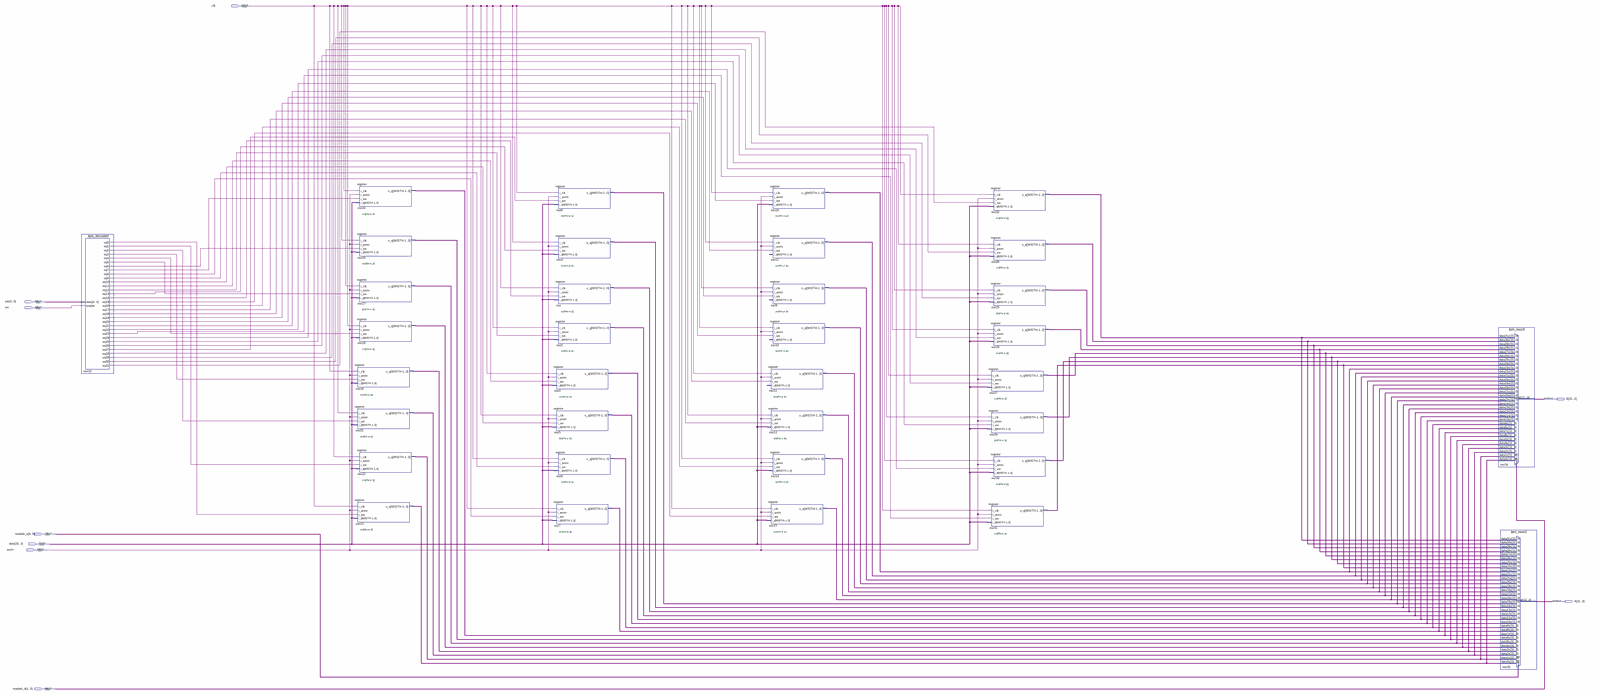
[diagram p0: schematic sheet, whole]
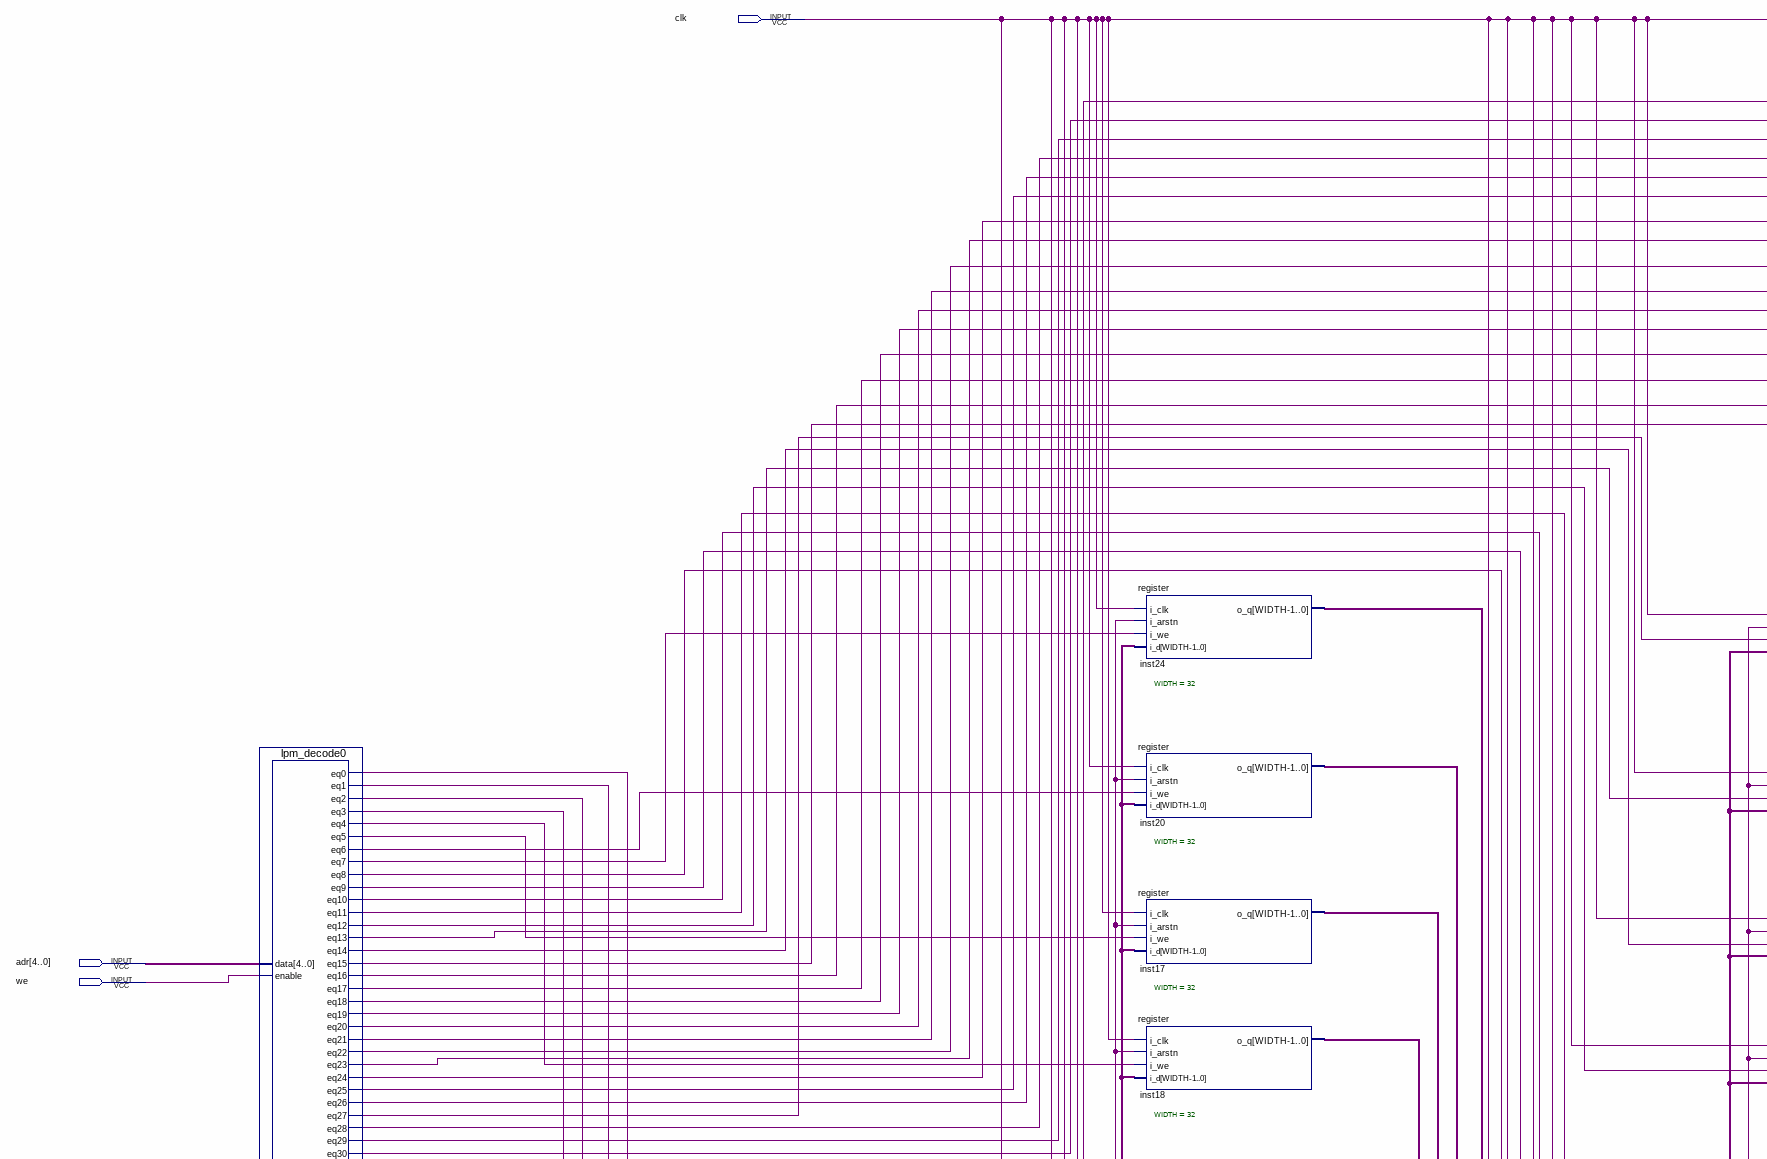
[diagram p1: schematic sheet, upper left part]
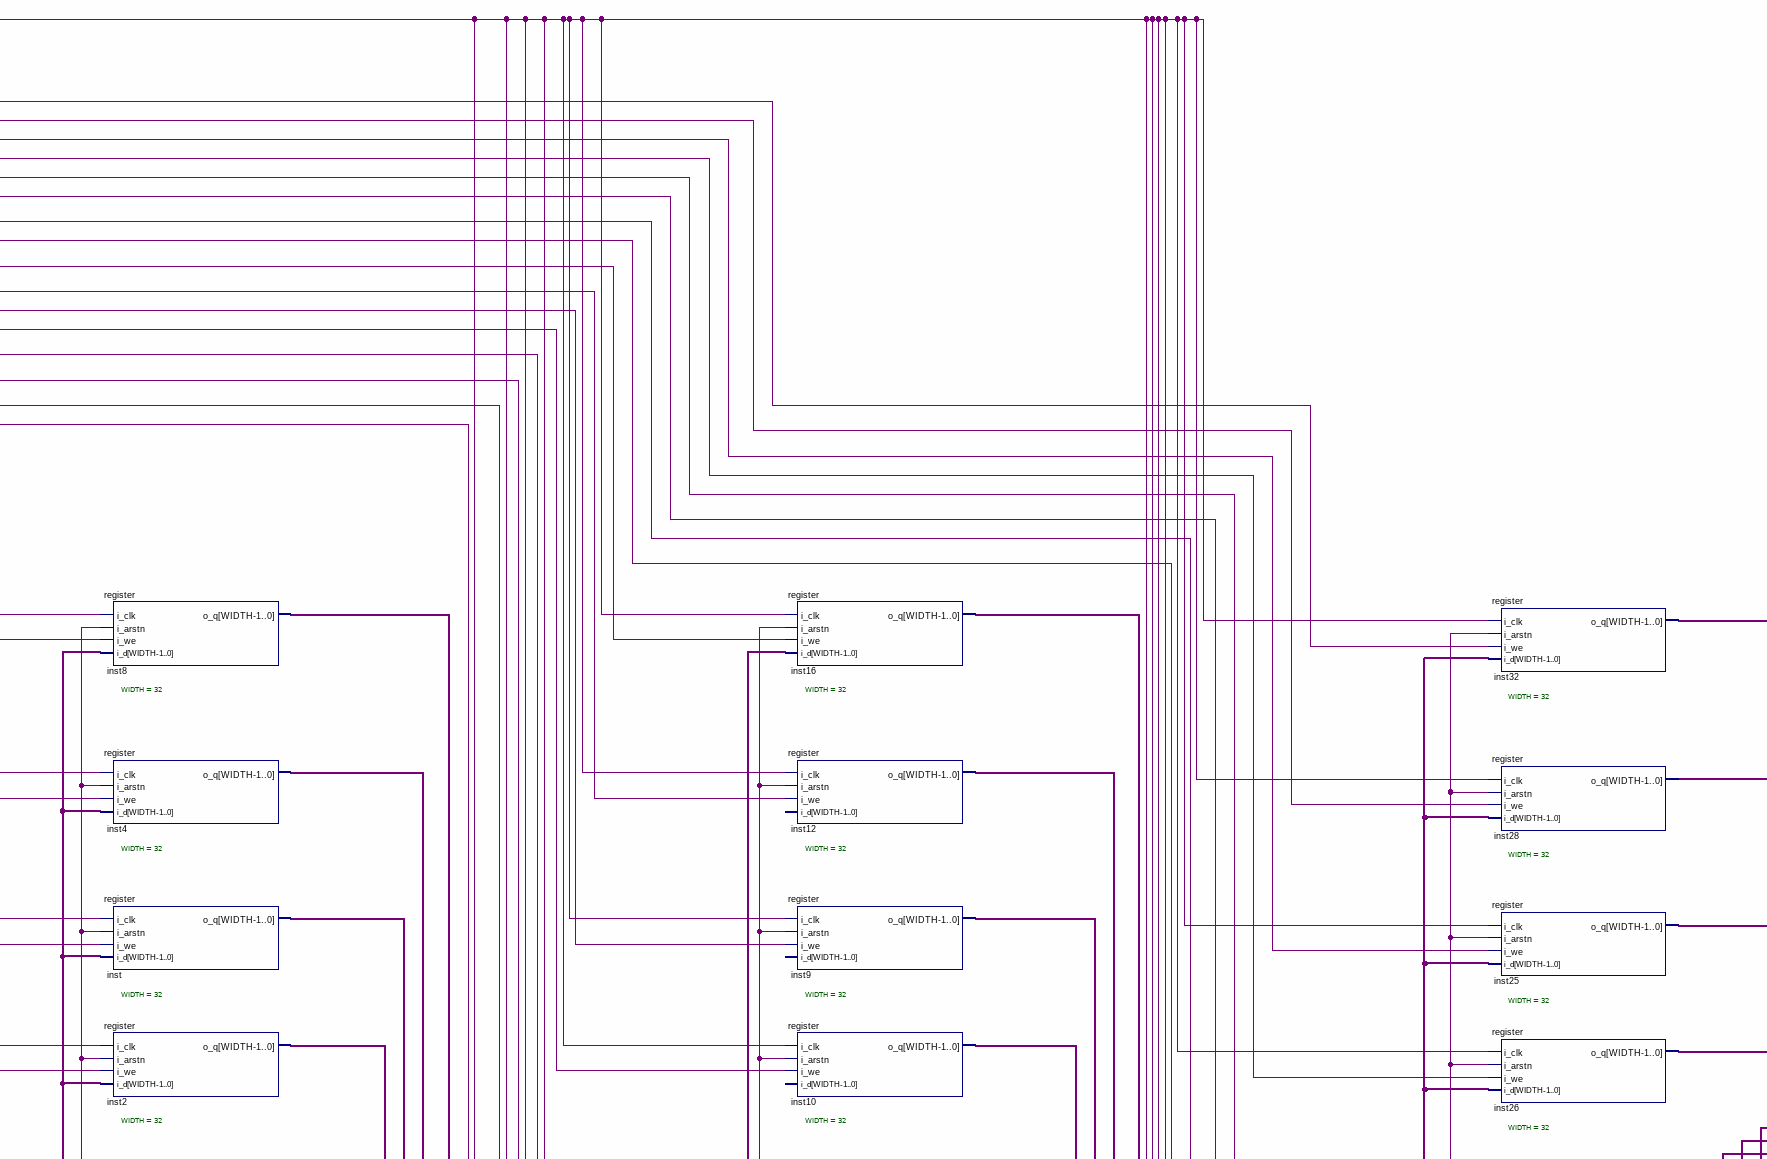
[diagram p2: schematic sheet, upper centre part]
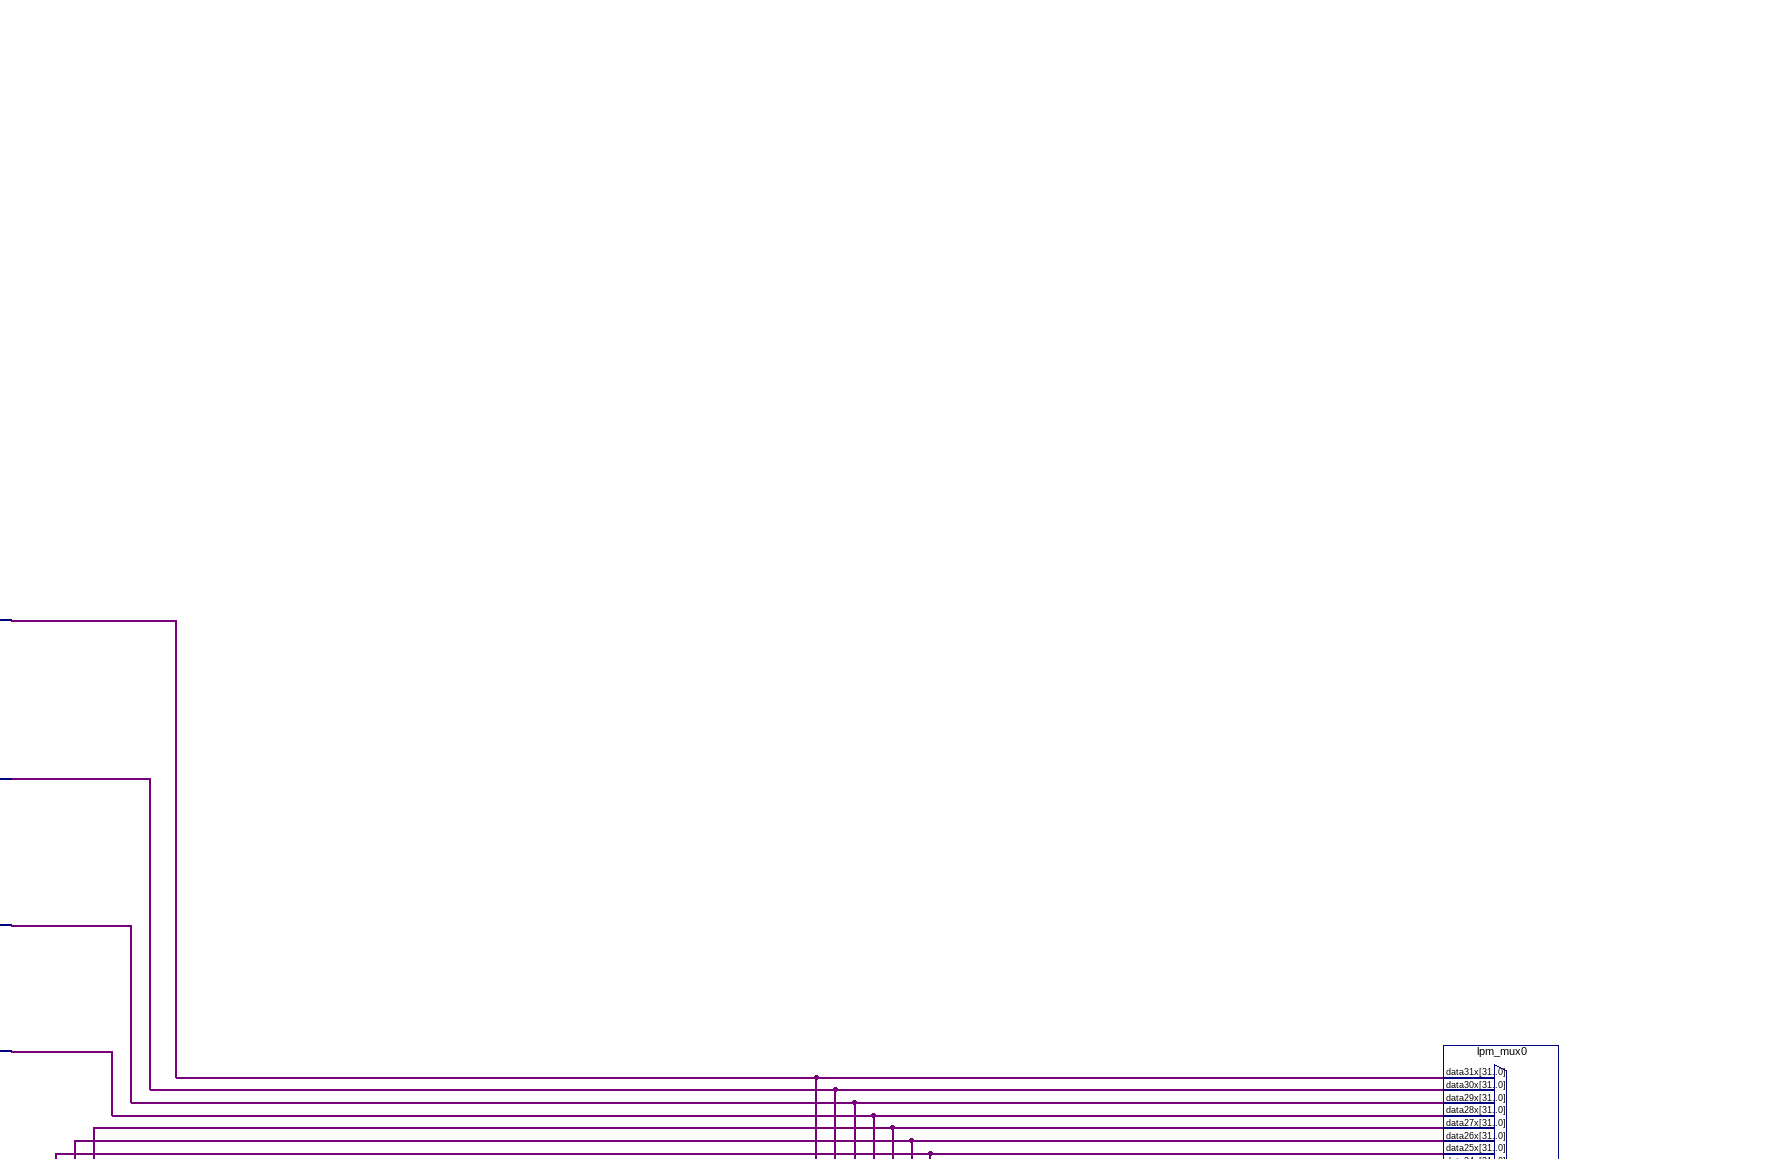
[diagram p3: schematic sheet, upper right part]
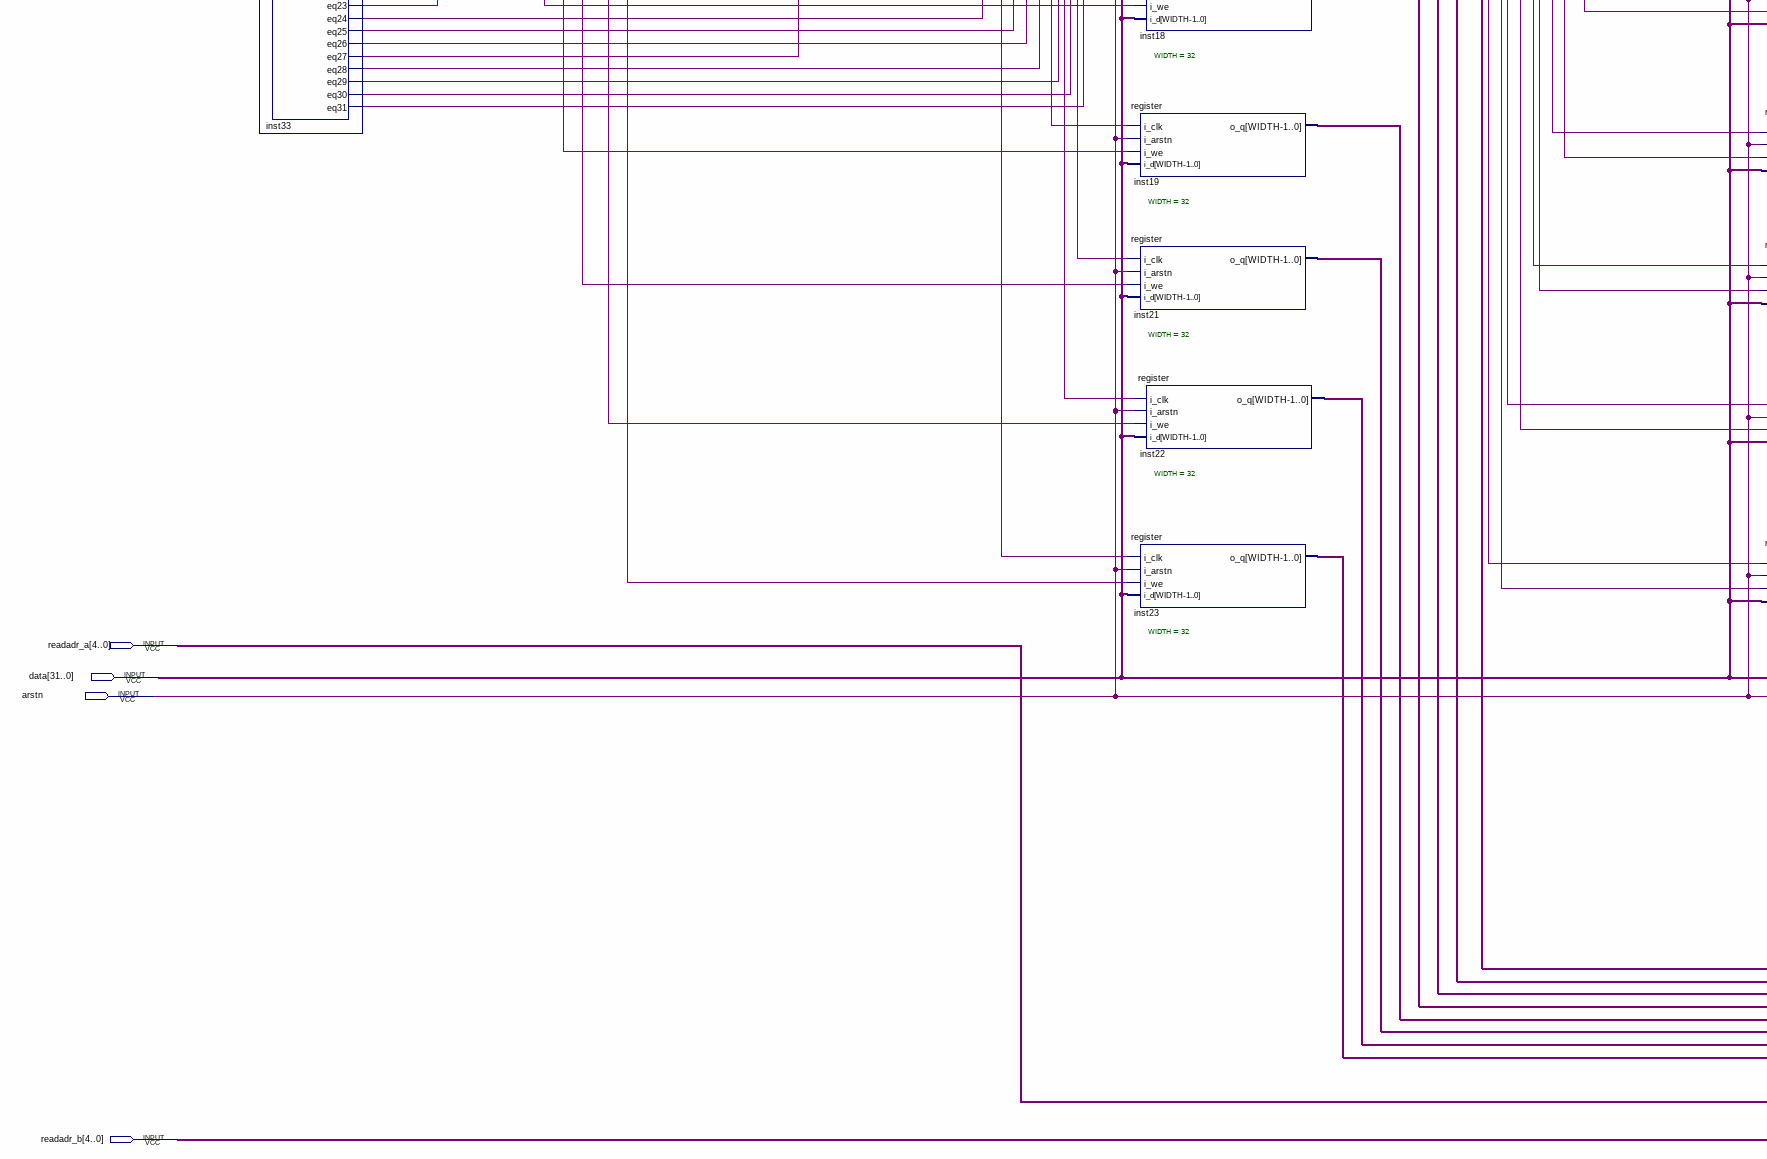
[diagram p4: schematic sheet, lower left part]
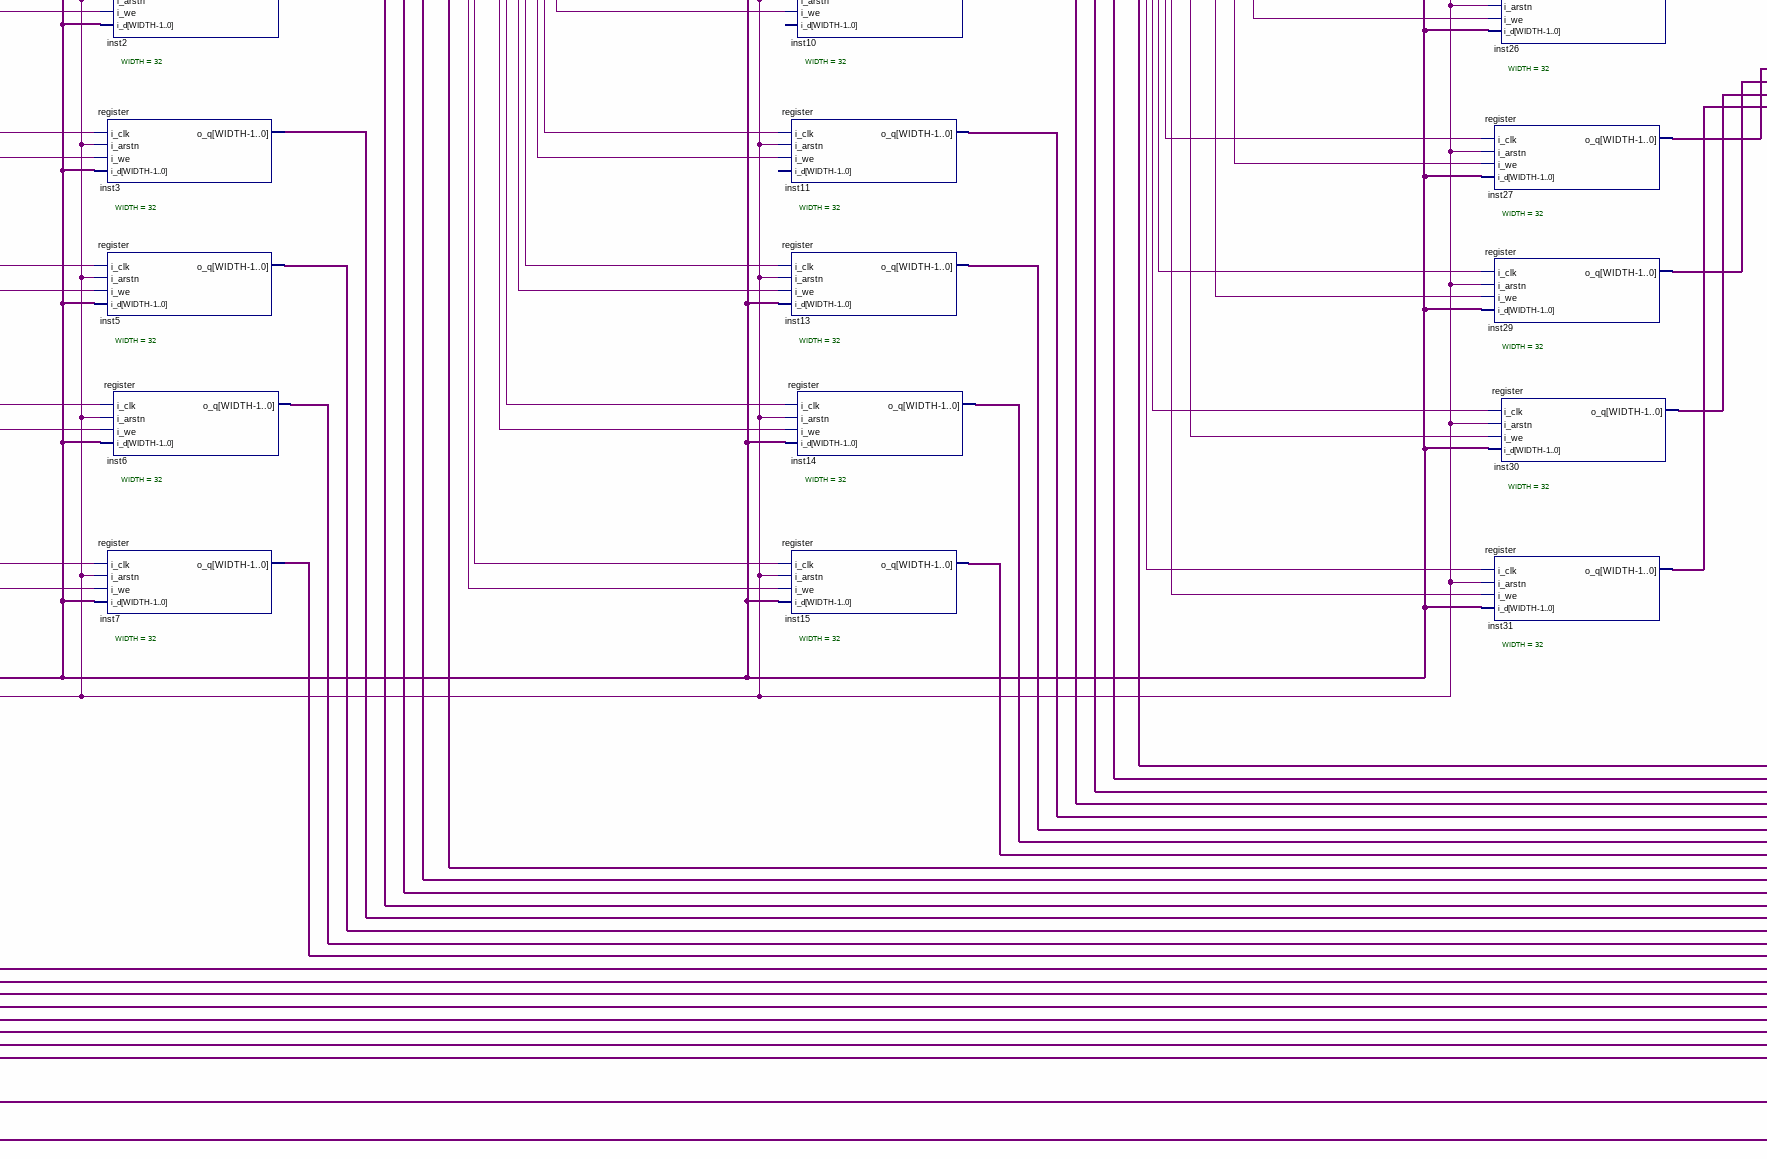
[diagram p5: schematic sheet, lower centre part]
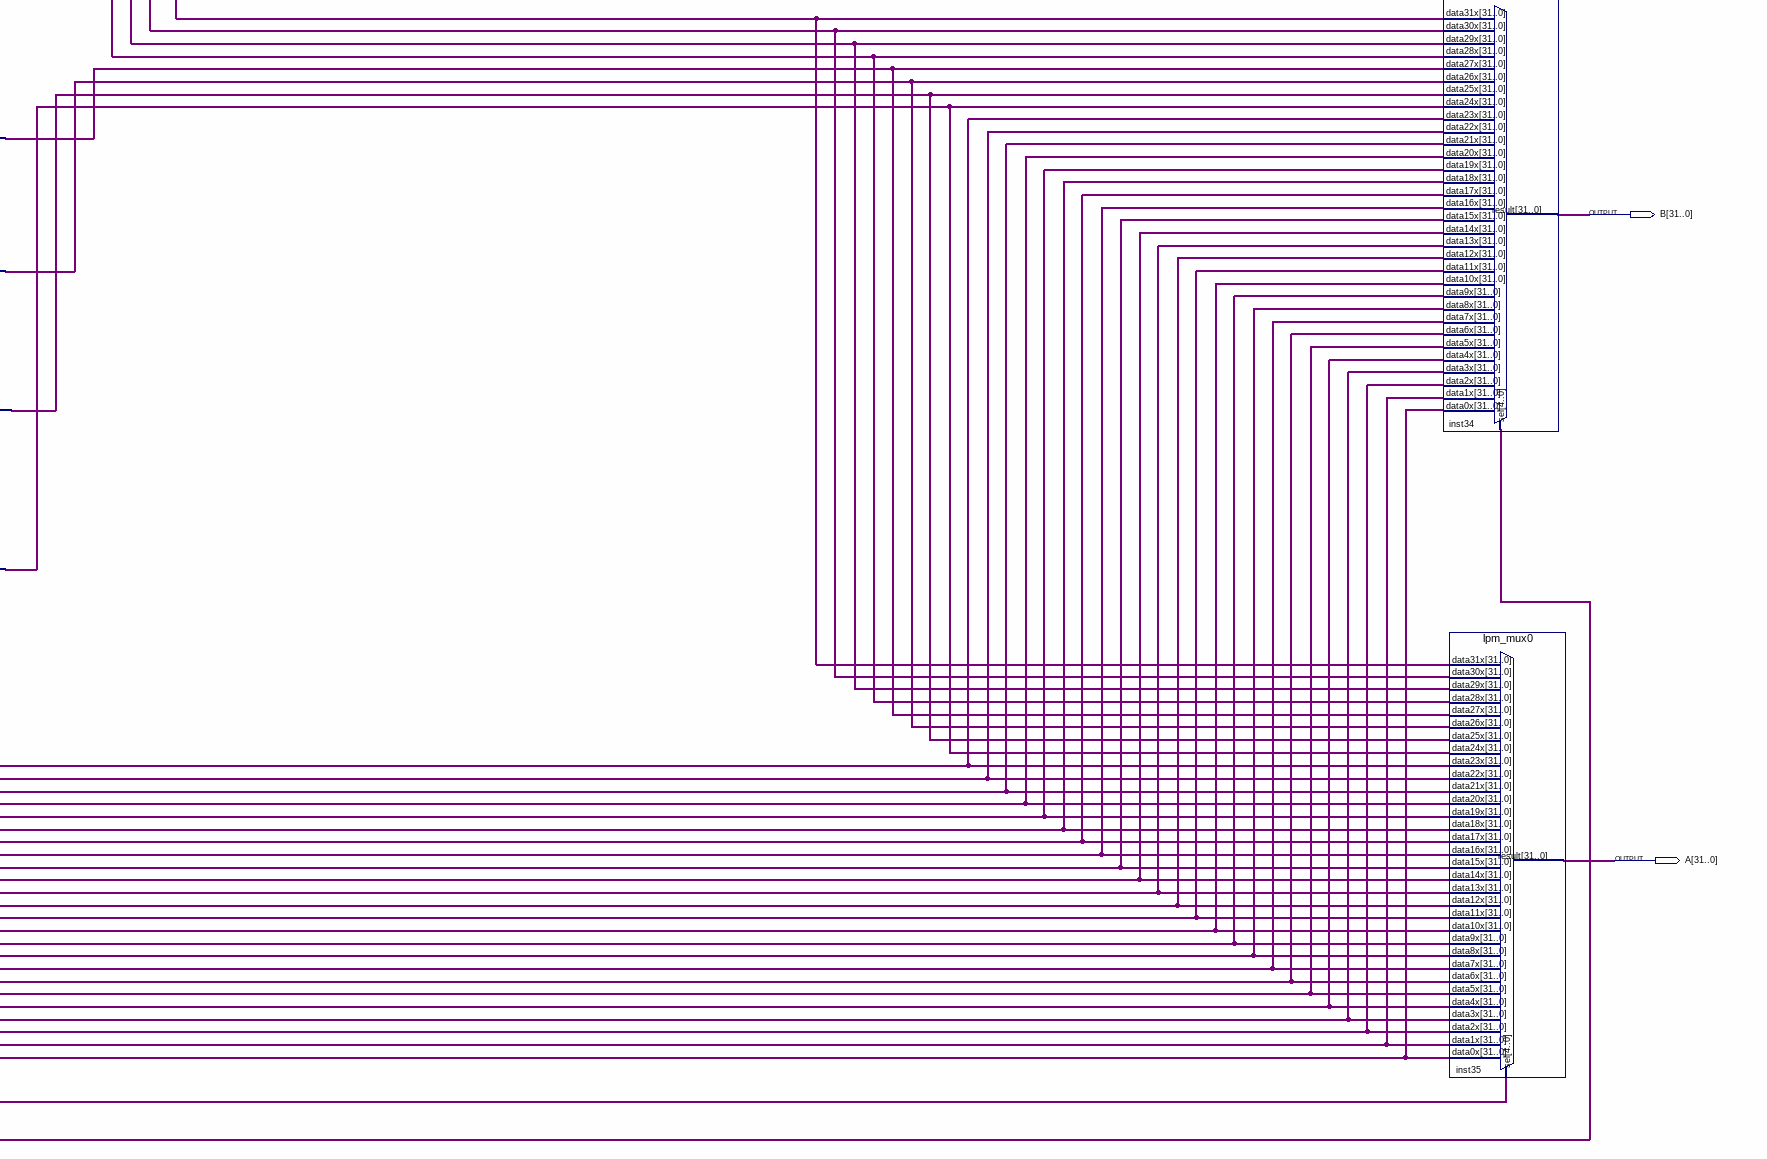
[diagram p6: schematic sheet, lower right part]
// Quartus schematic lab2_register_file.bdf as structural Verilog: 35 symbols, 9 pins
module lab2_register_file (
  input  clk,
  input  [4:0] adr,
  input  we,
  input  [4:0] readadr_a,
  input  [31:0] data,
  input  arstn,
  input  [4:0] readadr_b,
  output [31:0] B,
  output [31:0] A
);

  wire inst33_eq0, inst33_eq1, inst33_eq2, inst33_eq3, inst33_eq4, inst33_eq5, inst33_eq6, inst33_eq7,
       inst33_eq8, inst33_eq9, inst33_eq10, inst33_eq11, inst33_eq12, inst33_eq13, inst33_eq14, inst33_eq15,
       inst33_eq16, inst33_eq17, inst33_eq18, inst33_eq19, inst33_eq20, inst33_eq21, inst33_eq22,
       inst33_eq23, inst33_eq24, inst33_eq25, inst33_eq26, inst33_eq27, inst33_eq28, inst33_eq29,
       inst33_eq30, inst33_eq31;
  wire [31:0] inst2_o_q, inst3_o_q, inst4_o_q, inst5_o_q, inst6_o_q, inst7_o_q, inst8_o_q, inst9_o_q,
       inst10_o_q, inst11_o_q, inst12_o_q, inst13_o_q, inst14_o_q, inst15_o_q, inst16_o_q, inst17_o_q,
       inst18_o_q, inst19_o_q, inst20_o_q, inst21_o_q, inst22_o_q, inst23_o_q, inst24_o_q, inst25_o_q,
       inst26_o_q, inst27_o_q, inst28_o_q, inst29_o_q, inst30_o_q, inst31_o_q, inst32_o_q, inst_o_q;

  lpm_decode0 inst33 (
    .data(adr), .enable(we), .eq0(inst33_eq0), .eq1(inst33_eq1), .eq2(inst33_eq2), .eq3(inst33_eq3),
    .eq4(inst33_eq4), .eq5(inst33_eq5), .eq6(inst33_eq6), .eq7(inst33_eq7), .eq8(inst33_eq8),
    .eq9(inst33_eq9), .eq10(inst33_eq10), .eq11(inst33_eq11), .eq12(inst33_eq12), .eq13(inst33_eq13),
    .eq14(inst33_eq14), .eq15(inst33_eq15), .eq16(inst33_eq16), .eq17(inst33_eq17), .eq18(inst33_eq18),
    .eq19(inst33_eq19), .eq20(inst33_eq20), .eq21(inst33_eq21), .eq22(inst33_eq22), .eq23(inst33_eq23),
    .eq24(inst33_eq24), .eq25(inst33_eq25), .eq26(inst33_eq26), .eq27(inst33_eq27), .eq28(inst33_eq28),
    .eq29(inst33_eq29), .eq30(inst33_eq30), .eq31(inst33_eq31));
  register #(.WIDTH(32)) inst24 (.i_clk(clk), .i_arstn(arstn), .i_we(inst33_eq7), .i_d(data), .o_q(inst24_o_q));
  register #(.WIDTH(32)) inst20 (.i_clk(clk), .i_arstn(arstn), .i_we(inst33_eq6), .i_d(data), .o_q(inst20_o_q));
  register #(.WIDTH(32)) inst17 (.i_clk(clk), .i_arstn(arstn), .i_we(inst33_eq5), .i_d(data), .o_q(inst17_o_q));
  register #(.WIDTH(32)) inst18 (.i_clk(clk), .i_arstn(arstn), .i_we(inst33_eq4), .i_d(data), .o_q(inst18_o_q));
  register #(.WIDTH(32)) inst19 (.i_clk(clk), .i_arstn(arstn), .i_we(inst33_eq3), .i_d(data), .o_q(inst19_o_q));
  register #(.WIDTH(32)) inst21 (.i_clk(clk), .i_arstn(arstn), .i_we(inst33_eq2), .i_d(data), .o_q(inst21_o_q));
  register #(.WIDTH(32)) inst22 (.i_clk(clk), .i_arstn(arstn), .i_we(inst33_eq1), .i_d(data), .o_q(inst22_o_q));
  register #(.WIDTH(32)) inst23 (.i_clk(clk), .i_arstn(arstn), .i_we(inst33_eq0), .i_d(data), .o_q(inst23_o_q));
  register #(.WIDTH(32)) inst8 (.i_clk(clk), .i_arstn(arstn), .i_we(inst33_eq27), .i_d(data), .o_q(inst8_o_q));
  register #(.WIDTH(32)) inst4 (.i_clk(clk), .i_arstn(arstn), .i_we(inst33_eq13), .i_d(data), .o_q(inst4_o_q));
  register #(.WIDTH(32)) inst (.i_clk(clk), .i_arstn(arstn), .i_we(inst33_eq14), .i_d(data), .o_q(inst_o_q));
  register #(.WIDTH(32)) inst2 (.i_clk(clk), .i_arstn(arstn), .i_we(inst33_eq12), .i_d(data), .o_q(inst2_o_q));
  register #(.WIDTH(32)) inst3 (.i_clk(clk), .i_arstn(arstn), .i_we(inst33_eq11), .i_d(data), .o_q(inst3_o_q));
  register #(.WIDTH(32)) inst5 (.i_clk(clk), .i_arstn(arstn), .i_we(inst33_eq10), .i_d(data), .o_q(inst5_o_q));
  register #(.WIDTH(32)) inst6 (.i_clk(clk), .i_arstn(arstn), .i_we(inst33_eq9), .i_d(data), .o_q(inst6_o_q));
  register #(.WIDTH(32)) inst7 (.i_clk(clk), .i_arstn(arstn), .i_we(inst33_eq8), .i_d(data), .o_q(inst7_o_q));
  register #(.WIDTH(32)) inst16 (.i_clk(clk), .i_arstn(arstn), .i_we(inst33_eq22), .i_d(data), .o_q(inst16_o_q));
  register #(.WIDTH(32)) inst12 (.i_clk(clk), .i_arstn(arstn), .i_we(inst33_eq21), .o_q(inst12_o_q));  // open: i_d
  register #(.WIDTH(32)) inst9 (.i_clk(clk), .i_arstn(arstn), .i_we(inst33_eq20), .o_q(inst9_o_q));  // open: i_d
  register #(.WIDTH(32)) inst10 (.i_clk(clk), .i_arstn(arstn), .i_we(inst33_eq19), .o_q(inst10_o_q));  // open: i_d
  register #(.WIDTH(32)) inst11 (.i_clk(clk), .i_arstn(arstn), .i_we(inst33_eq18), .o_q(inst11_o_q));  // open: i_d
  register #(.WIDTH(32)) inst13 (.i_clk(clk), .i_arstn(arstn), .i_we(inst33_eq17), .i_d(data), .o_q(inst13_o_q));
  register #(.WIDTH(32)) inst14 (.i_clk(clk), .i_arstn(arstn), .i_we(inst33_eq16), .i_d(data), .o_q(inst14_o_q));
  register #(.WIDTH(32)) inst15 (.i_clk(clk), .i_arstn(arstn), .i_we(inst33_eq15), .i_d(data), .o_q(inst15_o_q));
  register #(.WIDTH(32)) inst27 (.i_clk(clk), .i_arstn(arstn), .i_we(inst33_eq26), .i_d(data), .o_q(inst27_o_q));
  register #(.WIDTH(32)) inst29 (.i_clk(clk), .i_arstn(arstn), .i_we(inst33_eq25), .i_d(data), .o_q(inst29_o_q));
  register #(.WIDTH(32)) inst31 (.i_clk(clk), .i_arstn(arstn), .i_we(inst33_eq23), .i_d(data), .o_q(inst31_o_q));
  register #(.WIDTH(32)) inst32 (.i_clk(clk), .i_arstn(arstn), .i_we(inst33_eq31), .i_d(data), .o_q(inst32_o_q));
  register #(.WIDTH(32)) inst28 (.i_clk(clk), .i_arstn(arstn), .i_we(inst33_eq30), .i_d(data), .o_q(inst28_o_q));
  register #(.WIDTH(32)) inst25 (.i_clk(clk), .i_arstn(arstn), .i_we(inst33_eq29), .i_d(data), .o_q(inst25_o_q));
  register #(.WIDTH(32)) inst26 (.i_clk(clk), .i_arstn(arstn), .i_we(inst33_eq28), .i_d(data), .o_q(inst26_o_q));
  register #(.WIDTH(32)) inst30 (.i_clk(clk), .i_arstn(arstn), .i_we(inst33_eq24), .i_d(data), .o_q(inst30_o_q));
  lpm_mux0 inst34 (
    .data31x(inst32_o_q), .data30x(inst28_o_q), .data29x(inst25_o_q), .data28x(inst26_o_q),
    .data27x(inst27_o_q), .data26x(inst29_o_q), .data25x(inst30_o_q), .data24x(inst31_o_q),
    .data23x(inst16_o_q), .data22x(inst12_o_q), .data21x(inst9_o_q), .data20x(inst10_o_q),
    .data19x(inst11_o_q), .data18x(inst13_o_q), .data17x(inst14_o_q), .data16x(inst15_o_q),
    .data15x(inst8_o_q), .data14x(inst4_o_q), .data13x(inst_o_q), .data12x(inst2_o_q), .data11x(inst3_o_q),
    .data10x(inst5_o_q), .data9x(inst6_o_q), .data8x(inst7_o_q), .data7x(inst24_o_q), .data6x(inst20_o_q),
    .data5x(inst17_o_q), .data4x(inst18_o_q), .data3x(inst19_o_q), .data2x(inst21_o_q), .data1x(inst22_o_q),
    .data0x(inst23_o_q), .sel(readadr_b), .result(B));
  lpm_mux0 inst35 (
    .data31x(inst32_o_q), .data30x(inst28_o_q), .data29x(inst25_o_q), .data28x(inst26_o_q),
    .data27x(inst27_o_q), .data26x(inst29_o_q), .data25x(inst30_o_q), .data24x(inst31_o_q),
    .data23x(inst16_o_q), .data22x(inst12_o_q), .data21x(inst9_o_q), .data20x(inst10_o_q),
    .data19x(inst11_o_q), .data18x(inst13_o_q), .data17x(inst14_o_q), .data16x(inst15_o_q),
    .data15x(inst8_o_q), .data14x(inst4_o_q), .data13x(inst_o_q), .data12x(inst2_o_q), .data11x(inst3_o_q),
    .data10x(inst5_o_q), .data9x(inst6_o_q), .data8x(inst7_o_q), .data7x(inst24_o_q), .data6x(inst20_o_q),
    .data5x(inst17_o_q), .data4x(inst18_o_q), .data3x(inst19_o_q), .data2x(inst21_o_q), .data1x(inst22_o_q),
    .data0x(inst23_o_q), .sel(readadr_a), .result(A));
endmodule
